# EAGLE design arm_pb (EAGLE 5.10)
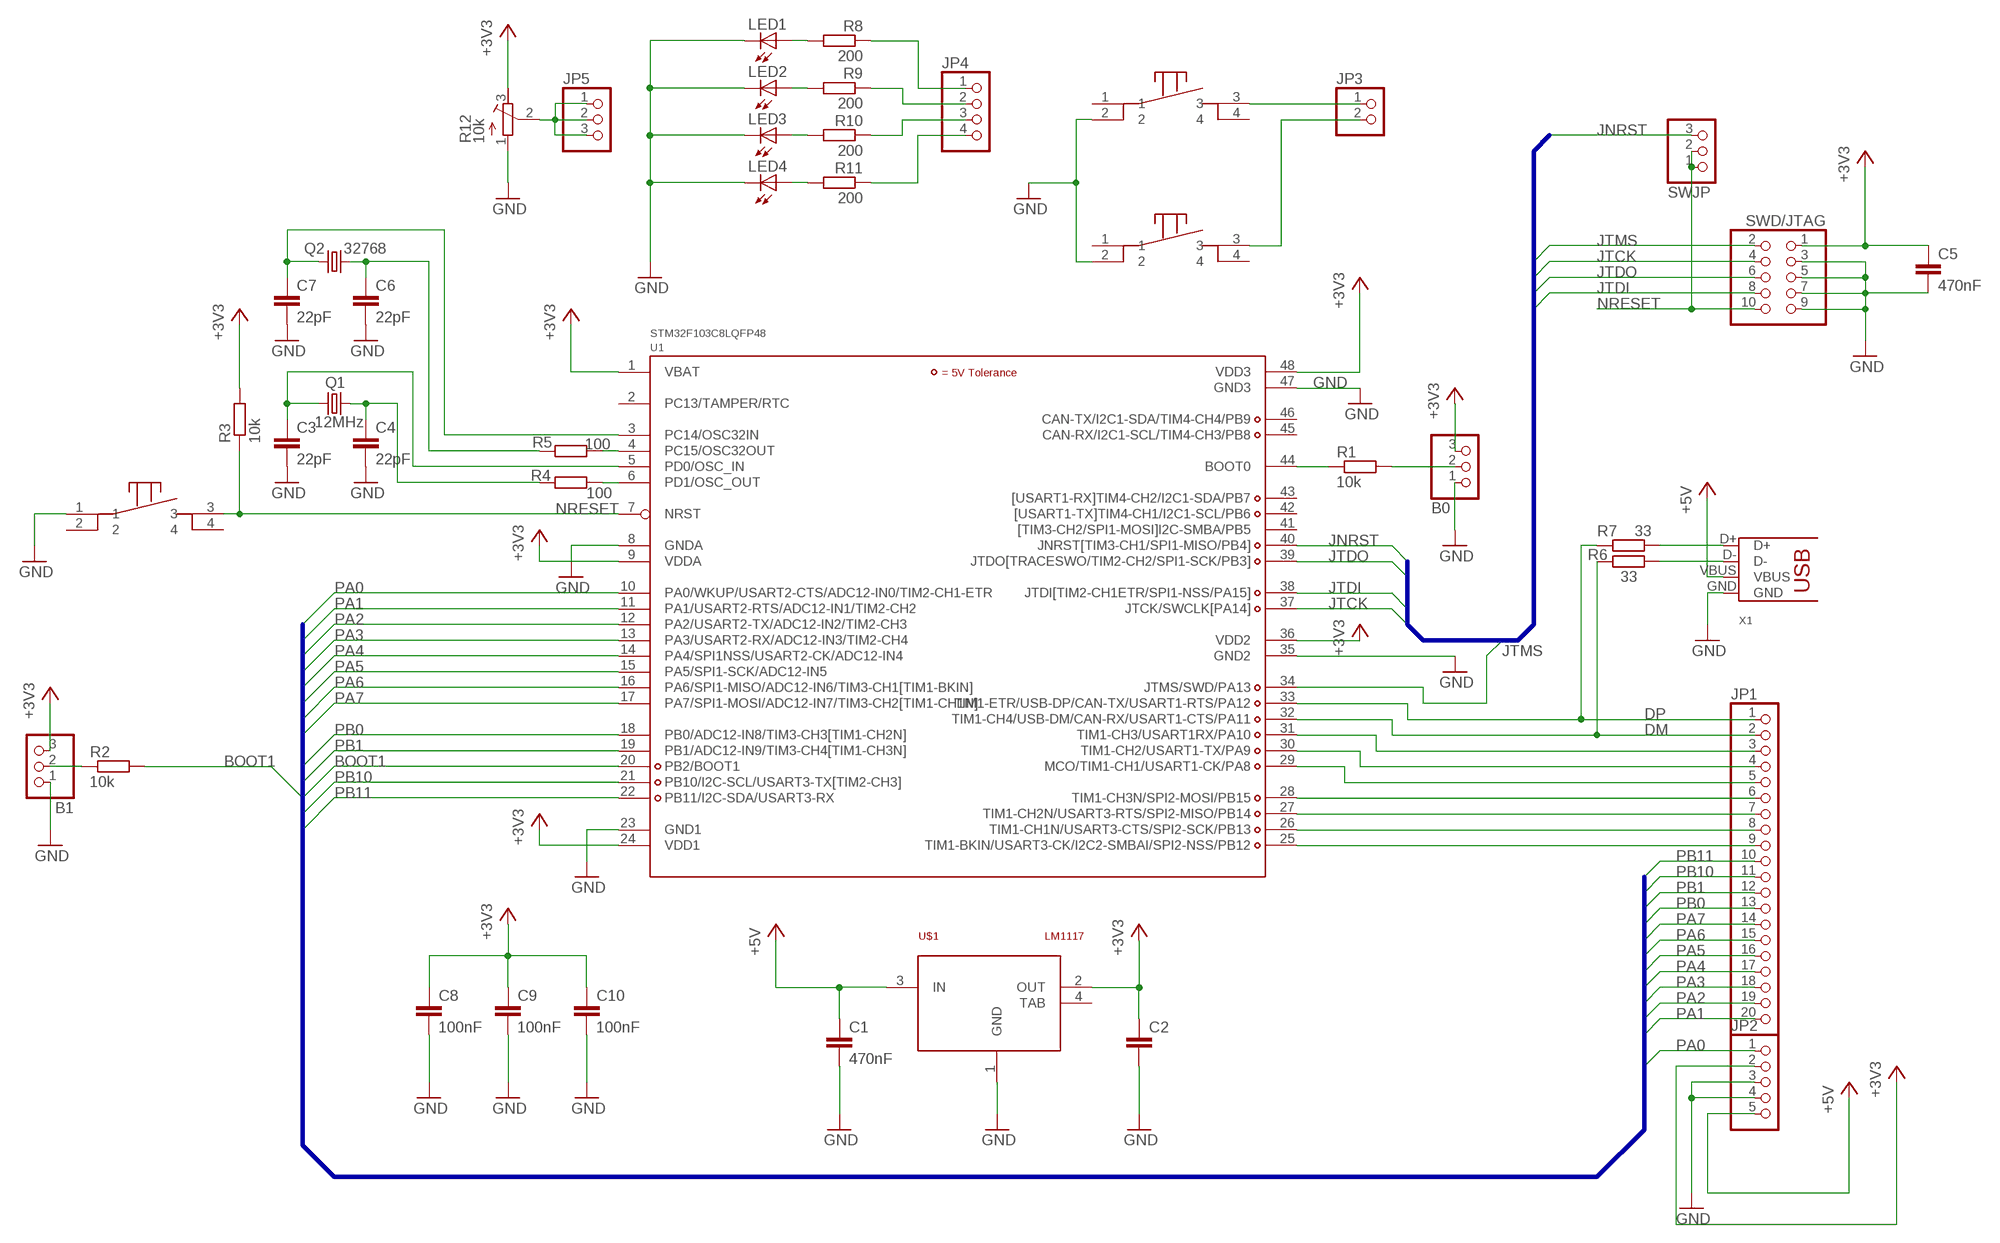
[diagram p0: schematic, sheet 1]

## Parts
B0  PINHD-1X3  [1X03]
B1  PINHD-1X3  [1X03]
C1  470nF  C-EUC1206  [C1206]
C2  C-EUC1206  [C1206]
C3  22pF  C-EUC1206  [C1206]
C4  22pF  C-EUC1206  [C1206]
C5  470nF  C-EUC1206  [C1206]
C6  22pF  C-EUC1206  [C1206]
C7  22pF  C-EUC1206  [C1206]
C8  100nF  C-EUC1206  [C1206]
C9  100nF  C-EUC1206  [C1206]
C10  100nF  C-EUC1206  [C1206]
JP1  PINHD-1X20  [1X20]
JP2  PINHD-1X5  [1X05]
JP3  PINHD-1X2  [1X02]
JP4  PINHD-1X4  [1X04]
JP5  PINHD-1X3  [1X03]
LED1  SMDLED  [C0805]
LED2  SMDLED  [C0805]
LED3  SMDLED  [C0805]
LED4  SMDLED  [C0805]
Q1  12MHz  CRYSTALHC49U70  [HC49U70]
Q2  32768  CRYSTALTC26H  [TC26H]
R1  10k  R-EU_R1206  [R1206]
R2  10k  R-EU_R1206  [R1206]
R3  10k  R-EU_R1206  [R1206]
R4  100  R-EU_R1206  [R1206]
R5  100  R-EU_R1206  [R1206]
R6  33  R-EU_R1206  [R1206]
R7  33  R-EU_R1206  [R1206]
R8  200  R-EU_R1206  [R1206]
R9  200  R-EU_R1206  [R1206]
R10  200  R-EU_R1206  [R1206]
R11  200  R-EU_R1206  [R1206]
R12  10k  R-TRIMM64W  [RTRIM64W]
SWD/JTAG  PINHD-2X5  [2X05]
SWJP  PINHD-1X3  [1X03]
U1  STM32F103C8LQFP48  [LQFP48]
U$1  LM1117  [SOT223]
U$2  TAKTBUTTON  [TAKT]
U$3  TAKTBUTTON  [TAKT]
U$4  TAKTBUTTON  [TAKT]
X1  USB-B-H  [USB-B-H]

## Nets
+3V3: B0.3 B1.3 C2.1 C5.1 C8.1 C9.1 C10.1 JP2.2 R3.2 R12.3(A) SWD/JTAG.1 U1.1(VBAT) U1.9(VDDA) U1.24(VDD1) U1.36(VDD2) U1.48(VDD3) U$1.2(OUT)
+5V: C1.1 JP2.5 U$1.3(IN) X1.VBUS
BOOT1: R2.2 U1.20(PB2/BOOT1)
DM: JP1.2 R6.1 U1.32(TIM1-CH4/USB-DM/CAN-RX/USART1-CTS/PA11)
DP: JP1.1 R7.1 U1.33(TIM1-ETR/USB-DP/CAN-TX/USART1-RTS/PA12)
GND: B0.1 B1.1 C1.2 C2.2 C3.2 C4.2 C5.2 C6.2 C7.2 C8.2 C9.2 C10.2 JP2.3 JP2.4 LED1.KATHODE(K) LED2.KATHODE(K) LED3.KATHODE(K) LED4.KATHODE(K) R12.1(E) SWD/JTAG.3 SWD/JTAG.5 SWD/JTAG.7 SWD/JTAG.9 U1.8(GNDA) U1.23(GND1) U1.35(GND2) U1.47(GND3) U$1.1(GND) U$2.1 U$3.2 U$4.2 X1.GND
JNRST: SWJP.3 U1.40(JNRST[TIM3-CH1/SPI1-MISO/PB4])
JTCK: SWD/JTAG.4 U1.37(JTCK/SWCLK[PA14])
JTDI: SWD/JTAG.8 U1.38(JTDI[TIM2-CH1ETR/SPI1-NSS/PA15])
JTDO: SWD/JTAG.6 U1.39(JTDO[TRACESWO/TIM2-CH2/SPI1-SCK/PB3])
JTMS: SWD/JTAG.2 U1.34(JTMS/SWD/PA13)
N$1: R1.1 U1.44(BOOT0)
N$2: B0.2 R1.2
N$3: B1.2 R2.1
N$4: C7.1 Q2.1 U1.3(PC14/OSC32IN)
N$5: JP3.1 U$3.3
N$6: R7.2 X1.D+
N$7: JP3.2 U$4.3
N$8: JP1.3 U1.31(TIM1-CH3/USART1RX/PA10)
N$9: JP1.4 U1.30(TIM1-CH2/USART1-TX/PA9)
N$10: JP1.5 U1.29(MCO/TIM1-CH1/USART1-CK/PA8)
N$11: JP1.6 U1.28(TIM1-CH3N/SPI2-MOSI/PB15)
N$12: JP1.7 U1.27(TIM1-CH2N/USART3-RTS/SPI2-MISO/PB14)
N$13: JP1.8 U1.26(TIM1-CH1N/USART3-CTS/SPI2-SCK/PB13)
N$14: JP1.9 U1.25(TIM1-BKIN/USART3-CK/I2C2-SMBAI/SPI2-NSS/PB12)
N$15: C3.1 Q1.2 U1.5(PD0/OSC_IN)
N$16: C4.1 Q1.1 R4.2
N$17: R4.1 U1.6(PD1/OSC_OUT)
N$18: C6.1 Q2.2 R5.2
N$19: R5.1 U1.4(PC15/OSC32OUT)
N$20: R6.2 X1.D-
N$21: LED1.ANODE(A) R8.2
N$22: LED2.ANODE(A) R9.2
N$23: LED3.ANODE(A) R10.2
N$24: LED4.ANODE(A) R11.2
N$26: JP4.1 R8.1
N$27: JP4.2 R9.1
N$28: JP4.3 R10.1
N$29: JP4.4 R11.1
N$30: JP5.1 JP5.2 JP5.3 R12.2(S)
NRESET: R3.1 SWD/JTAG.10 SWJP.1 SWJP.2 U1.7(NRST) U$2.3
PA0: JP2.1 U1.10(PA0/WKUP/USART2-CTS/ADC12-IN0/TIM2-CH1-ETR)
PA1: JP1.20 U1.11(PA1/USART2-RTS/ADC12-IN1/TIM2-CH2)
PA2: JP1.19 U1.12(PA2/USART2-TX/ADC12-IN2/TIM2-CH3)
PA3: JP1.18 U1.13(PA3/USART2-RX/ADC12-IN3/TIM2-CH4)
PA4: JP1.17 U1.14(PA4/SPI1NSS/USART2-CK/ADC12-IN4)
PA5: JP1.16 U1.15(PA5/SPI1-SCK/ADC12-IN5)
PA6: JP1.15 U1.16(PA6/SPI1-MISO/ADC12-IN6/TIM3-CH1[TIM1-BKIN])
PA7: JP1.14 U1.17(PA7/SPI1-MOSI/ADC12-IN7/TIM3-CH2[TIM1-CH1N])
PB0: JP1.13 U1.18(PB0/ADC12-IN8/TIM3-CH3[TIM1-CH2N])
PB1: JP1.12 U1.19(PB1/ADC12-IN9/TIM3-CH4[TIM1-CH3N])
PB10: JP1.11 U1.21(PB10/I2C-SCL/USART3-TX[TIM2-CH3])
PB11: JP1.10 U1.22(PB11/I2C-SDA/USART3-RX)
Unconnected: U1.2(PC13/TAMPER/RTC) U1.41([TIM3-CH2/SPI1-MOSI]I2C-SMBA/PB5) U1.42([USART1-TX]TIM4-CH1/I2C1-SCL/PB6) U1.43([USART1-RX]TIM4-CH2/I2C1-SDA/PB7) U1.45(CAN-RX/I2C1-SCL/TIM4-CH3/PB8) U1.46(CAN-TX/I2C1-SDA/TIM4-CH4/PB9) U$1.4(TAB) U$2.2 U$2.4 U$3.1 U$3.4 U$4.1 U$4.4

## Buses
DEBUG
B$1

## Library data of the parts
B0 B1 JP5 SWJP = pinhead:PINHD-1X3: PIN HEADER
C1-C10 = rcl:C-EU: CAPACITOR, European symbol
JP1 = pinhead:PINHD-1X20: PIN HEADER
JP2 = pinhead:PINHD-1X5: PIN HEADER
JP3 = pinhead:PINHD-1X2: PIN HEADER
JP4 = pinhead:PINHD-1X4: PIN HEADER
LED1-LED4 = simple_led:SMDLED: SMD LED
Q1 Q2 = crystal:CRYSTAL: CRYSTAL
R1-R11 = rcl:R-EU_: RESISTOR, European symbol
R12 = rcl:R-TRIMM: Trimm resistor
SWD/JTAG = pinhead:PINHD-2X5: PIN HEADER
U1 = STM32:STM32F103C8
U$1 = power:LM1117
U$2-U$4 = buttons:TAKTBUTTON
X1 = con-usb-3:USB: USB Connectors

## Board
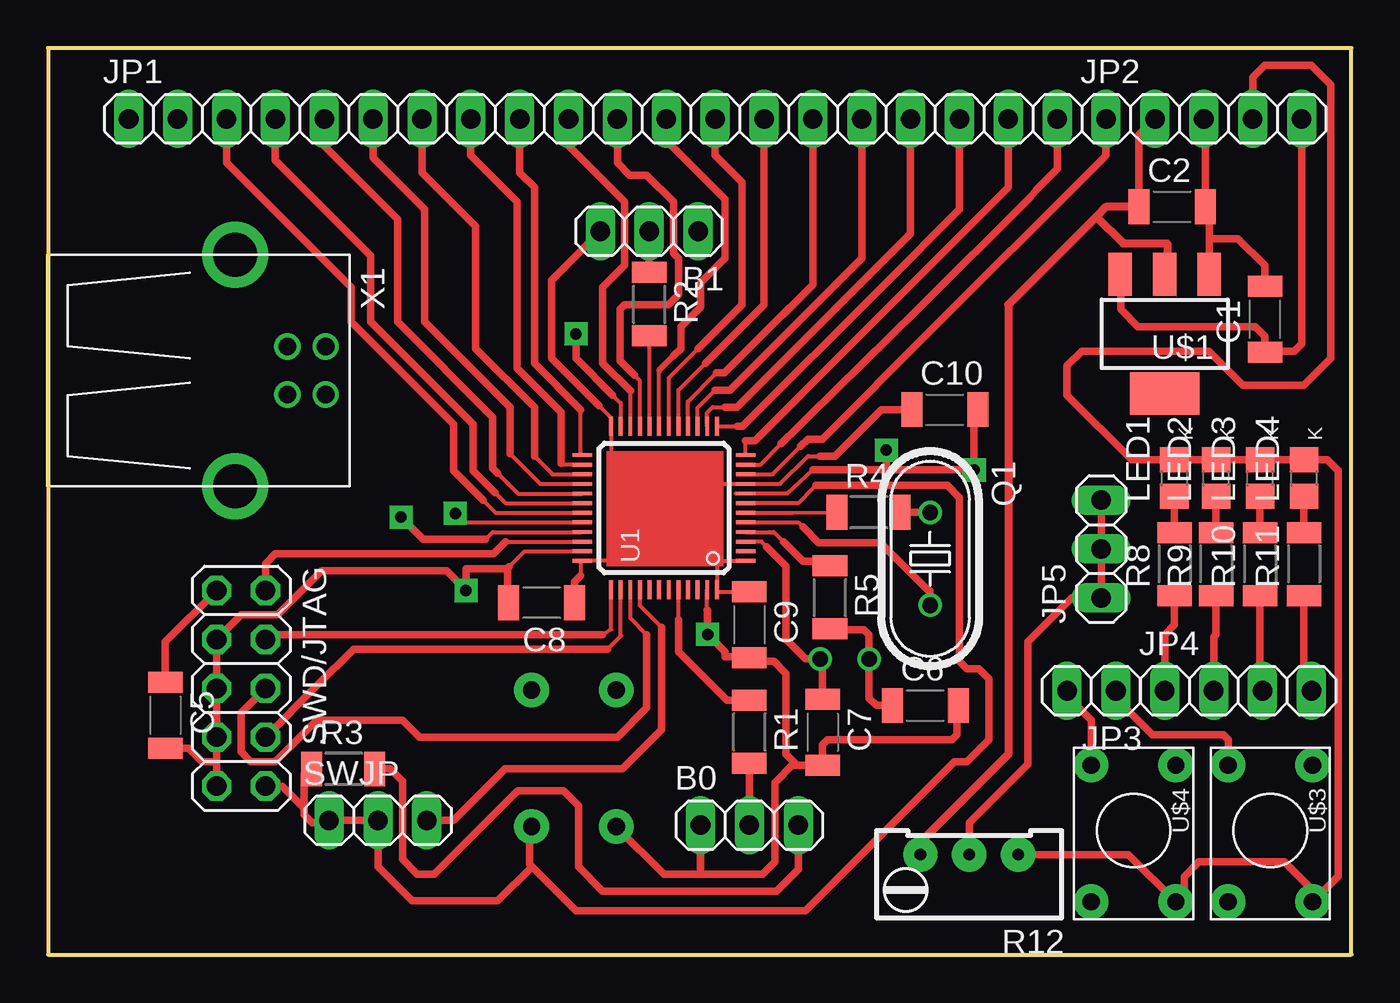
[diagram p1: board, top side]
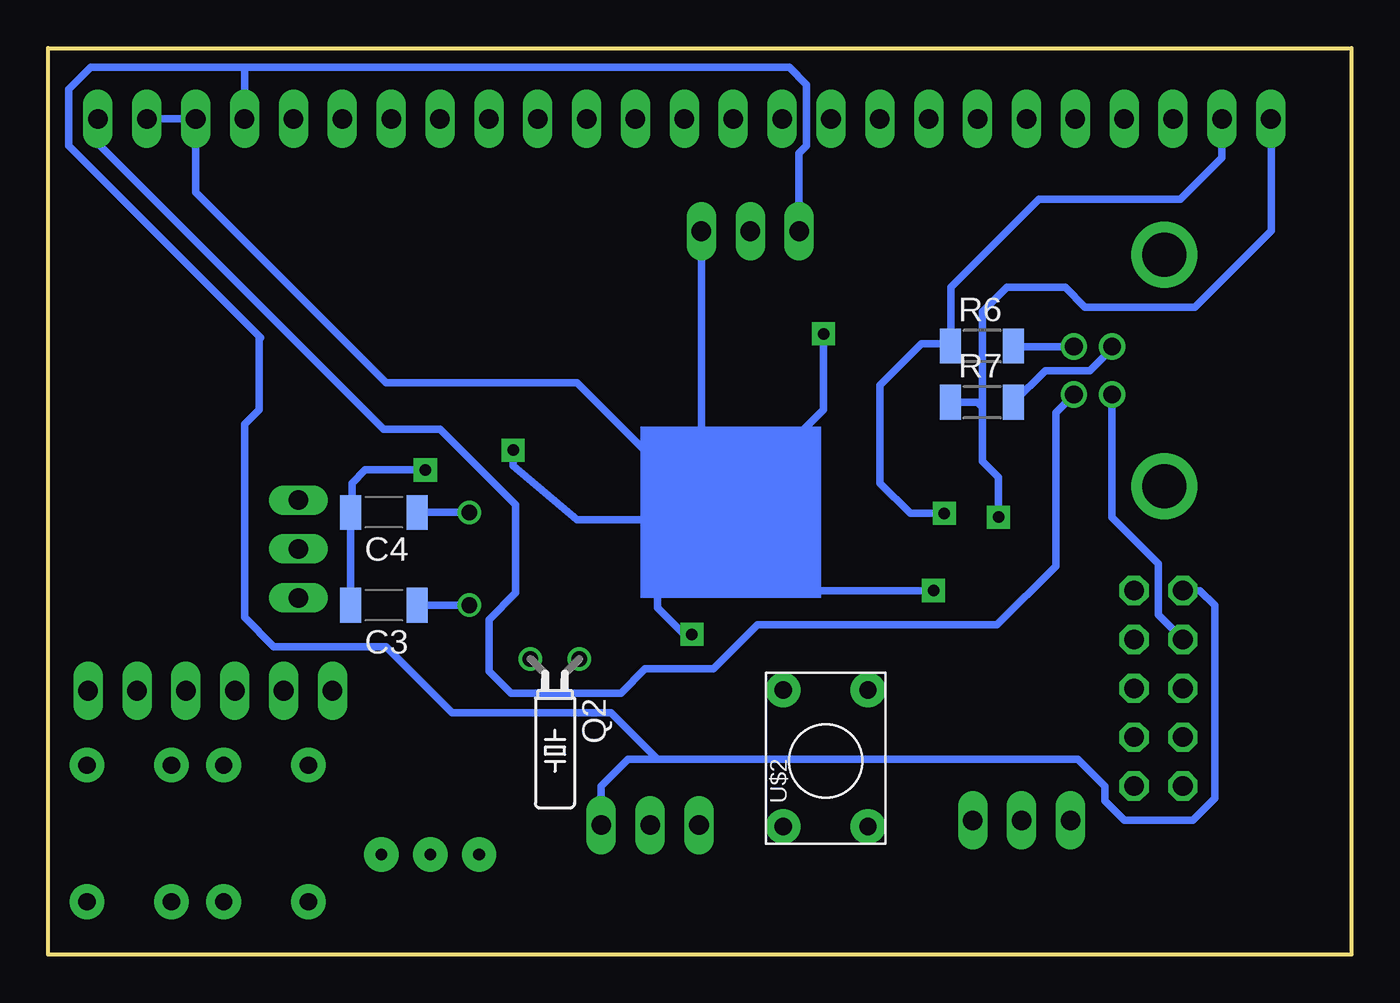
[diagram p2: board, bottom side, seen from below]

Size 67.74 x 47.11 mm. Coordinates in mm from the lower left corner, seen from the top.
Outline: 0,0 67.74,0 67.74,47.11 0,47.11 0,0
Copper layers (1*16): Top 0.035mm / dielectric 1.5mm / Bottom 0.035mm
Design rules "default *": minimum track width 0.2mm, minimum drill 0.6mm, track to track 0.2mm, track to pad 0.2mm, pad to pad 0.2mm, via to via 0.2mm, smd to smd 8mil, copper to edge 40mil, drill to drill 2mm, minimum pad ring 0.2mm, minimum via ring 0.3mm, stop-mask expansion 4mil, vias tented up to drill 0mil, thermal gap 10mil

### Footprints (pad centres in the part's own frame; a part is rotated, then mirrored left to right if it is on the bottom)
1X03 = drill 1.016 long: 1 -2.54,0; 2 0,0; 3 2.54,0
C1206 = smd 1.092 x 1.8: 1 -1.718,0; 2 1.718,0
1X20 = drill 1.016 long: 1 -24.13,0; 2 -21.59,0; 3 -19.05,0; 4 -16.51,0; 5 -13.97,0; 6 -11.43,0; 7 -8.89,0; 8 -6.35,0; 9 -3.81,0; 10 -1.27,0; 11 1.27,0; 12 3.81,0; 13 6.35,0; 14 8.89,0; 15 11.43,0; 16 13.97,0; 17 16.51,0; 18 19.05,0; 19 21.59,0; 20 24.13,0
1X05 = drill 1.016 long: 1 -5.08,0; 2 -2.54,0; 3 0,0; 4 2.54,0; 5 5.08,0
1X02 = drill 1.016 long: 1 -1.27,0; 2 1.27,0
1X04 = drill 1.016 long: 1 -3.81,0; 2 -1.27,0; 3 1.27,0; 4 3.81,0
C0805 = smd 1.3 x 1.5: ANODE -0.95,0; KATHODE 0.95,0
HC49U70 = drill 0.813 round: 1 -2.413,0; 2 2.413,0
TC26H = drill 0.813 round: 1 -1.27,0; 2 1.27,0
R1206 = smd 1.092 x 1.803: 1 -1.676,0; 2 1.613,0
RTRIM64W = drill 0.61 pad 1.778 round: 1 1.27,-2.54; 2 1.27,0; 3 1.27,2.54
2X05 = drill 1.016 octagon: 1 -5.08,-1.27; 2 -5.08,1.27; 3 -2.54,-1.27; 4 -2.54,1.27; 5 0,-1.27; 6 0,1.27; 7 2.54,-1.27; 8 2.54,1.27; 9 5.08,-1.27; 10 5.08,1.27
LQFP48 = smd 0.2 x 1: 1 -2.75,-4.25; 2 -2.25,-4.25; 3 -1.75,-4.25; 4 -1.25,-4.25; 5 -0.75,-4.25; 6 -0.25,-4.25; 7 0.25,-4.25; 8 0.75,-4.25; 9 1.25,-4.25; 10 1.75,-4.25; 11 2.25,-4.25; 12 2.75,-4.25; 25 2.75,4.25; 26 2.25,4.25; 27 1.75,4.25; 28 1.25,4.25; 29 0.75,4.25; 30 0.25,4.25; 31 -0.25,4.25; 32 -0.75,4.25; 33 -1.25,4.25; 34 -1.75,4.25; 35 -2.25,4.25; 36 -2.75,4.25 | smd 1 x 0.2: 13 4.25,-2.75; 14 4.25,-2.25; 15 4.25,-1.75; 16 4.25,-1.25; 17 4.25,-0.75; 18 4.25,-0.25; 19 4.25,0.25; 20 4.25,0.75; 21 4.25,1.25; 22 4.25,1.75; 23 4.25,2.25; 24 4.25,2.75; 37 -4.25,2.75; 38 -4.25,2.25; 39 -4.25,1.75; 40 -4.25,1.25; 41 -4.25,0.75; 42 -4.25,0.25; 43 -4.25,-0.25; 44 -4.25,-0.75; 45 -4.25,-1.25; 46 -4.25,-1.75; 47 -4.25,-2.25; 48 -4.25,-2.75
SOT223 = smd 1.219 x 2.235: 1 -2.311,-3.099; 2 0,-3.099; 3 2.311,-3.099 | smd 3.6 x 2.2: 4 0,3.099
TAKT = drill 0.9 pad 1.8 round: 1 -3.5,2.1; 2 3.6,2.1; 3 -3.5,-2.3; 4 3.6,-2.3
USB-B-H = drill 0.914 round: D+ 0,1.25; D- 1.981,1.25; GND 0,-1.25; VBUS 1.981,-1.25 | drill 2.286 round: P$1 -2.718,-6.02; P$2 -2.718,6.02

### Placement (x,y rotation side)
B0  36.45,6.73 0 top
B1  31.24,37.59 180 top
C1  63.25,33.02 90 top
C2  58.42,38.86 0 top
C3  50.29,18.16 180 bottom
C4  50.29,22.99 180 bottom
C5  6.1,12.45 270 top
C6  45.59,12.95 0 top
C7  40.26,11.56 270 top
C8  25.65,18.29 180 top
C9  36.45,17.14 270 top
C10  46.61,28.32 0 top
JP1  28.32,43.43 0 top
JP2  60.07,43.43 0 top
JP3  54.23,13.72 180 top
JP4  61.85,13.72 0 top
JP5  54.74,21.08 90 top
LED1  58.55,24.77 90 top
LED2  60.71,24.77 90 top
LED3  62.99,24.77 90 top
LED4  65.28,24.77 90 top
Q1  45.85,20.57 270 top
Q2  41.4,15.37 180 bottom
R1  36.45,11.56 270 top
R2  31.24,33.78 270 top
R3  15.37,9.65 0 top
R4  42.67,22.99 0 top
R5  40.64,18.54 270 top
R6  19.18,31.62 0 bottom
R7  19.18,28.7 0 bottom
R8  58.55,20.32 90 top
R9  60.71,20.32 90 top
R10  62.99,20.32 90 top
R11  65.28,20.32 90 top
R12  47.88,3.94 90 top
SWD/JTAG  10.03,13.84 270 top
SWJP  17.15,6.98 0 top
U1  32.01,23.21 90 top
U$1  58.04,32.26 180 top
U$2  27.43,10.16 90 bottom
U$3  63.63,6.35 270 top
U$4  56.52,6.35 270 top
X1  12.45,30.35 0 top

### Tracks (layer width: path | path; a pad name or v marks a point on that pad's centre or on a via)
+3V3
  Top 0.2: 29.26,25.98 U1.24 29.26,27.89 28.64,28.53 | 34.57,24.46 U1.9 38.05,24.46 39.5,25.91 40.13,25.91 | U1.36 | U1.1 34.93,20.46 34.76,20.3 U1.48 34.86,18.86 C9.1 | U1.36 29.23,20.46 29.34,20.57 | 27.69,19.68 27.69,20.39 U1.36
  Top 0.4: 28.64,28.53 26.16,30.99 26.16,35.05 B1.3 | 32.13,23.11 32.38,22.86 | 29.26,25.98 32.13,23.11 | 34.57,24.46 33.48,24.46 32.13,23.11 | 29.34,20.57 30.1,20.57 32.38,22.86 | C8.1 27.37,19.37 27.69,19.68 | 40.13,25.91 40.89,25.91 43.31,28.32 C10.1 | B0.3 38.99,4.45 37.85,3.3 28.83,3.3 27.56,4.57 27.56,7.75 26.8,8.51 24.44,8.51 24.4,8.47 24.34,8.47 20.07,4.19 19.18,4.19 18.41,4.95 18.41,9.02 17.78,9.65 R3.2 | 32.38,22.86 32.38,22.74 33.66,21.46 34.42,21.46 34.8,21.08 34.8,20.59 34.93,20.46 | 56.7,38.8 C2.1 56.7,42.6 JP2.2 | 58.17,35.48 U$1.2 | C5.1 6.1,16.26 SWD/JTAG.1
  Top 0.406: R12.3 45.34,5.84 49.91,10.41 49.91,33.78 54.48,38.35 | 54.48,38.35 54.99,38.86 C2.1 | 58.17,35.48 58.17,36.96 55.88,36.96 54.48,38.35
  Bottom 0.4: 36.07,10.16 37.59,10.16 38.99,8.76 B0.3 | 36.07,10.16 38.48,12.57 46.74,12.57 50.16,16 56.01,16 57.53,17.53 57.53,27.56 56.77,28.32 56.77,32 56.7,32.06 66.68,42.04 66.68,44.96 65.53,46.1 57.53,46.1 | B1.3 28.7,41.66 28.32,42.04 28.32,45.21 29.21,46.1 57.53,46.1 | 57.53,46.1 JP2.2 | 36.07,10.16 14.22,10.16 12.83,8.76 12.83,8 11.81,6.98 8.25,6.98 7.11,8.13 7.11,18.16 7.87,18.92 SWD/JTAG.1
+5V
  Top 0.4: 55.3,34.92 U$1.3 55.75,35.33 55.75,33.53 56.64,32.64 62.74,32.64 63.25,32.13 C1.1 63.31,31.37 64.77,31.37 65.15,31.75 JP2.5
  Bottom 0.4: JP2.5 65.15,42.16 50.29,27.3 47.37,27.3 43.43,23.37 43.43,18.8 44.83,17.4 44.83,14.73 43.69,13.59 37.97,13.59 36.7,14.86 33.15,14.86 30.86,17.14 18.41,17.14 15.37,20.19 15.37,28.16 X1.VBUS
BOOT1
  Top 0.2: U1.20 31.26,31.77 R2.2
DM  (via drill 0.6)
  Top 0.2: U1.32 21.63,22.46 v21.16,22.93
  Bottom 0.4: v21.16,22.93 22.93,22.93 24.51,24.51 24.51,29.59 22.35,31.75 20.98,31.75 R6.1 20.83,31.65 20.83,34.67 16.26,39.24 8.89,39.24 6.73,41.4 JP1.2
DP  (via drill 0.6 pad 0.81)
  Top 0.2: U1.33 23.11,21.96 22.73,21.59
  Top 0.4: 22.73,21.59 19.89,21.59 19.49,21.59 v18.34,22.74
  Bottom 0.2: 4.17,43.42 JP1.1
  Bottom 0.4: 4.17,43.42 4.17,37.61 8.13,33.66 13.84,33.66 14.86,34.67 17.91,34.67 19.18,33.4 19.18,28.45 | 19.18,28.45 19.18,25.65 18.34,24.82 v18.34,22.74 | R7.1 19.43,28.7 19.18,28.45
GND  (via drill 0.6)
  Top 0.2: 35.73,23.96 U1.8 38.41,23.96 39.77,25.19 | U1.35 24.77,20.96 23.95,20.15 | U1.47 34.26,17.91 | U1.23 29.76,28.66 29.34,29.08
  Top 0.4: 23.87,20.07 21.72,20.07 v21.72,18.92 20.7,19.94 14.22,19.94 12.83,18.54 11.94,17.65 10.03,17.65 SWD/JTAG.3 SWD/JTAG.5 SWD/JTAG.7 8.76,10.03 | 23.87,20.07 23.95,20.15 | 23.87,20.07 23.87,17.84 C8.2 | 38.92,9.84 38.35,10.41 38.35,14.61 37.72,15.24 36.64,15.24 C9.2 36.38,15.49 35.18,15.49 35.18,15.75 v34.28,16.64 34.28,17.89 34.26,17.91 | 38.92,9.84 C7.2 40.26,10.92 40.51,11.18 46.99,11.18 47.24,11.43 47.24,12.89 C6.2 | 43.31,25.19 39.77,25.19 | 43.31,25.19 v48.13,25.19 48.13,27.37 C10.2 | 38.92,9.84 38.67,9.84 37.85,9.02 37.85,9 37.78,8.94 37.78,4.84 37.13,4.19 33.99,4.19 | 33.99,4.19 32,4.19 U$2.1 | B0.1 33.91,4.27 33.99,4.19 | 8.76,10.03 SWD/JTAG.9 | v43.57,26.22 43.57,25.45 43.31,25.19 | v27.43,32.26 27.43,30.99 29.34,29.08 | 60.35,37.34 U$1.1 | 60.35,37.34 60.35,38.65 C2.2 60.14,43.37 JP2.3 | C1.2 63.25,35.81 61.85,37.21 60.48,37.21 60.35,37.34 | LED4.KATHODE LED3.KATHODE LED2.KATHODE LED1.KATHODE | LED1.KATHODE 66.49,25.72 67.06,25.15 67.06,4.08 U$3.2 65.73,3.36 64.26,4.83 59.82,4.83 59.05,4.06 59.05,3.19 U$4.2 56.16,5.21 R12.1 | LED1.KATHODE 56.33,25.72 52.96,29.08 52.96,30.61 53.72,31.37 60.32,31.37 62.1,29.59 65.28,29.59 66.68,30.99 66.68,45.21 65.66,46.23 63.25,46.23 62.61,45.59 JP2.4 | C5.2 6.8,10.73 7.31,10.73 8,10.03 8.76,10.03
  Bottom 0.4: v48.13,25.19 51.27,25.19 51.94,24.51 51.94,23.05 C4.2 C3.2 | B1.1 33.78,27.12 33.78,23.24 33.66,23.11 | X1.GND 12.45,25.53 12.45,22.73 12.06,22.35 11.18,21.46 10.03,20.32 10.03,17.65 SWD/JTAG.3 | JP2.4 JP2.3 60.07,39.62 50.16,29.72 41.02,29.72 40.26,29.72 33.66,23.11 | 43.57,25.93 v43.57,26.22 43.57,25.41 40.26,22.61 33.53,22.61 33.4,22.48 | v27.43,32.26 27.43,28.32 33.15,22.61 | 33.15,22.61 33.27,22.61 33.4,22.48 | v34.28,16.64 34.68,16.64 36.07,18.03 36.07,20.32 35.56,20.32 33.4,22.48 | v21.72,18.92 29.46,18.92 32.96,22.42 | 32.96,22.42 33.15,22.61 | 32.96,22.42 33.66,23.11
JNRST
  Top 0.2: SWJP.3 19.7,7 | U1.40 30.76,18.14 31.88,17.02
  Top 0.4: 31.88,17.02 31.88,11.68 29.84,9.65 23.75,9.65 21.08,6.98 SWJP.3
JTCK
  Top 0.2: U1.37 29.26,16.91 29.23,16.91 28.83,16.64
  Top 0.4: 28.83,16.64 12.95,16.64 11.56,16.64 SWD/JTAG.4
JTDI
  Top 0.2: 29.08,15.88 29.78,16.58 29.76,16.61 U1.38
  Top 0.4: SWD/JTAG.8 13.97,13.97 15.88,15.88 29.08,15.88
JTDO
  Top 0.2: U1.39 30.26,17.49 31.12,16.64
  Top 0.4: 31.12,16.64 31.12,12.83 29.59,11.3 19.3,11.3 18.41,12.19 13.97,12.19 11.81,10.03 10.54,10.03 10.03,10.54 10.03,12.57 SWD/JTAG.6
JTMS
  Top 0.2: 23.79,21.46 U1.34
  Top 0.4: 23.79,21.46 23.15,20.83 11.81,20.83 11.3,20.32 SWD/JTAG.2
N$1
  Top 0.2: 32.76,17.41 U1.44
  Top 0.4: R1.1 35.28,13.23 32.77,15.75 32.77,17.4 32.76,17.41
N$2
  Top 0.4: B0.2 R1.2
N$3
  Top 0.4: B1.2 R2.1
N$4
  Top 0.2: U1.3 37.02,21.46 37.08,21.46 37.34,21.21
  Top 0.4: C7.1 40.26,15.24 Q2.1 39.37,15.37 38.35,16.38 38.35,17.14 38.35,20.19 37.97,20.57 37.34,21.21
N$5
  Top 0.4: JP3.1 55.5,13.34 57.4,11.43 61.09,11.43 61.34,11.18 61.34,9.86 U$3.3
N$6
  Bottom 0.4: X1.D+ 12.45,31.5 13.59,30.35 15.91,30.35 R7.2
N$7
  Top 0.4: JP3.2 52.96,13.46 54.23,12.19 54.23,9.86 U$4.3
N$8
  Top 0.2: U1.31 23.27,22.96 22.61,23.62
  Top 0.4: 22.61,23.62 21.08,25.15 21.08,27.56 15.75,32.89 15.75,34.67 9.27,41.15 JP1.3
N$9
  Top 0.2: U1.30 23.78,23.46 23.24,24
  Top 0.4: 23.24,24 22.1,25.15 22.1,27.56 16.76,32.89 16.76,36.32 11.81,41.27 JP1.4
N$10
  Top 0.2: U1.29 24.42,23.96 23.37,25.02
  Top 0.4: JP1.5 14.35,42.04 18.16,38.23 18.16,32.89 23.11,27.94 23.11,25.27 23.37,25.02
N$11
  Top 0.2: U1.28 25.58,24.46 24,26.03
  Top 0.4: JP1.6 16.89,41.4 19.56,38.73 19.56,32.89 24,28.45 24,26.03
N$12
  Top 0.2: U1.27 26.22,24.96 25.27,25.91
  Top 0.4: JP1.7 19.43,40.64 22.23,37.85 22.23,31.5 25.27,28.45 25.27,25.91
N$13
  Top 0.2: U1.26 26.73,25.46 26.67,25.53
  Top 0.4: JP1.8 21.97,41.53 24.38,39.12 24.38,30.48 26.67,28.19 26.67,25.53
N$14
  Top 0.2: 27.69,28.32 27.69,26.04 U1.25
  Top 0.4: JP1.9 24.51,40.64 25.27,39.88 25.27,30.73 27.69,28.32
N$15
  Top 0.2: U1.5 37.31,22.46 38.08,22.47 39,22.47 39.24,22.23
  Top 0.4: Q1.2 45.85,18.92 45.76,18.92 43.26,21.42 40.05,21.42 39.24,22.23
  Bottom 0.4: Q1.2 C3.1
N$16
  Top 0.4: R4.2 Q1.1
  Bottom 0.4: Q1.1 C4.1
N$17
  Top 0.2: U1.6 38.69,22.96 R4.1
N$18
  Top 0.4: C6.1 43.05,12.95 42.67,13.34 Q2.2 42.67,16.64 42.42,16.89 40.68,16.89 R5.2
N$19
  Top 0.2: U1.4 37.47,21.96 37.73,21.96 38.23,21.46 | 40.41,20.45 R5.1
  Top 0.4: 40.41,20.45 39.24,20.45 38.23,21.46
N$20
  Bottom 0.4: X1.D- 17.55,31.6 R6.2
N$21
  Top 0.4: R8.2 LED1.ANODE
N$22
  Top 0.4: R9.2 LED2.ANODE
N$23
  Top 0.4: R10.2 LED3.ANODE
N$24
  Top 0.4: R11.2 LED4.ANODE
N$26
  Top 0.4: R8.1 58.55,17.14 58.04,16.64 JP4.1
N$27
  Top 0.4: R9.1 60.71,16.64 60.58,16.51 JP4.2
N$28
  Top 0.4: R10.1 62.99,14.61 JP4.3
N$29
  Top 0.4: R11.1 65.28,14.86 JP4.4
N$30
  Top 0.4: R12.2 47.88,6.86 50.93,9.91 50.93,16.26 53.21,18.54 JP5.1 JP5.2 JP5.3
NRESET
  Top 0.2: 13.31,9.39 R3.1 | U1.7 37.56,23.46 38.99,23.46 39.75,24.23 39.91,24.38 | 25.02,6.55 U$2.3
  Top 0.4: 39.91,24.38 46.74,24.38 47.37,23.75 47.37,18.41 47.37,15.24 47.75,14.86 48.39,14.86 48.89,14.35 48.89,11.18 47.75,10.03 47.62,10.03 47.12,10.03 39.37,2.29 27.43,2.29 25.15,4.57 | 25.15,4.57 25.02,4.7 25.02,6.55 U$2.3 | 25.15,4.57 23.37,2.79 18.92,2.79 17.15,4.57 SWJP.2 SWJP.1 14.48,6.86 13.72,6.86 13.31,7.26 13.31,7.62 | 13.31,7.62 13.31,9.39 | SWD/JTAG.10 12.17,8.76 13.31,7.62
PA0
  Top 0.2: U1.10 37.66,24.96 39.12,26.42
  Top 0.4: 39.12,26.42 39.5,26.8 40.26,26.8 45.85,32.38 54.36,40.89 54.86,41.4 54.99,41.53 JP2.1
PA1
  Top 0.2: U1.11 37.02,25.46 38.1,26.54
  Top 0.4: 38.1,26.54 38.99,27.43 39.5,27.94 45.21,33.53 51.05,39.37 51.38,39.75 52.45,40.83 JP1.20
PA2
  Top 0.2: U1.12 36.26,26.71
  Top 0.4: 36.26,26.71 36.75,26.71 39.75,29.72 49.91,39.88 JP1.19
PA3
  Top 0.2: U1.13 35.84,27.46
  Top 0.4: 35.84,27.46 36.1,27.46 43.43,34.8 47.37,38.73 JP1.18
PA4
  Top 0.2: U1.14 34.26,28.16 34.54,28.45 35.18,28.45
  Top 0.4: 35.18,28.45 35.81,28.45 37.46,30.1 44.83,37.47 JP1.17
PA5
  Top 0.2: U1.15 33.76,28.43 34.67,29.34
  Top 0.4: 34.67,29.34 35.43,29.34 42.29,36.2 JP1.16
PA6
  Top 0.2: U1.16 33.26,28.74 34.75,30.23
  Top 0.4: 34.75,30.23 35.14,30.23 38.55,33.63 38.19,33.25 39.74,34.8 JP1.15
PA7
  Top 0.2: U1.17 32.76,29.33 34.16,30.73
  Top 0.4: 34.16,30.73 37.21,33.78 37.21,42.16 JP1.14
PB0
  Top 0.2: U1.18 32.26,29.97 33.78,31.5
  Top 0.4: JP1.13 34.67,41.53 36.07,40.13 36.07,33.78 33.78,31.5
PB1
  Top 0.2: U1.19 31.76,30.36
  Top 0.3: 31.76,30.36 32.51,31.12
  Top 0.4: JP1.12 32.13,42.29 35.18,39.24 35.18,36.2 33.91,34.92 33.91,33.66 32.89,32.64 32.89,31.5 32.51,31.12
PB10
  Top 0.2: U1.21 30.76,29.8 30.76,29.82 30.48,30.1
  Top 0.4: 30.48,30.1 29.72,30.86 29.72,33.53 29.97,33.78 32.26,33.78 32.77,34.29 32.77,36.2 32.51,36.45 32.51,39.12 31.12,40.51 30.23,40.51 29.59,41.15 JP1.11
PB11
  Top 0.2: U1.22 30.26,29.3
  Top 0.4: 30.26,29.3 28.83,30.73 28.83,34.67 29.97,35.81 29.97,39.12 27.05,42.04 JP1.10
(copper drawn outside any net)
  shapes: Bottom area x1, Top area x1